# EasyEDA Pro project 串口模块.epro, board 车载蓝牙供电串口V2
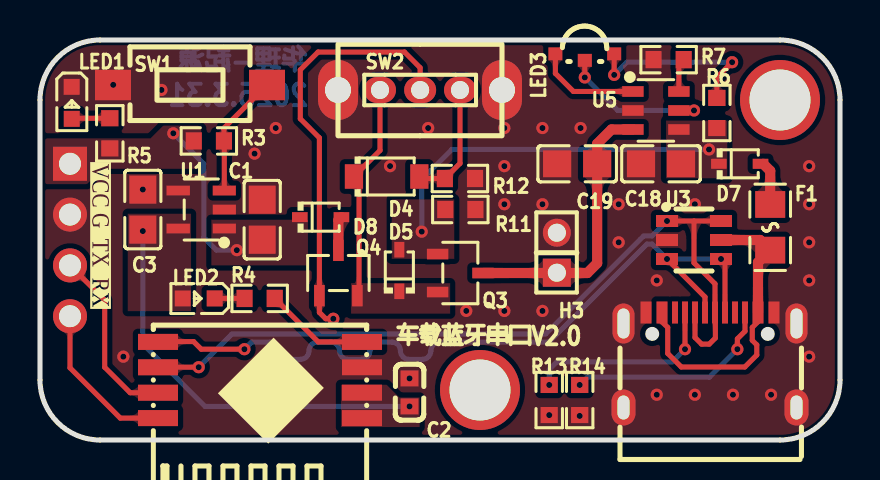
[diagram p8: board, top side]
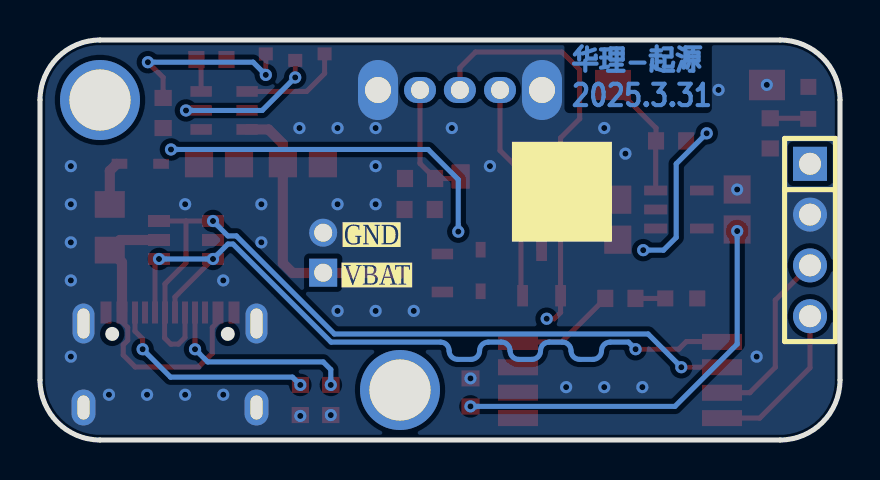
[diagram p9: board, bottom side, seen from below]

Outline 40 x 20 mm; copper layers: Top Layer, Bottom Layer. Coordinates in mm from the lower left corner of the outline.
Outline path: 0,17 0,3 arc(0.88,0.88) 3,0 37,0 arc(39.12,0.88) 40,3 40,17 arc(39.12,19.12) 37,20 3,20 arc(0.88,19.12) 0,17
Stack: Top Layer 0.035mm / Dielectric1 1.51mm FR4 er 4.5 / Bottom Layer 0.035mm

## Design rules (mm)
net D+: DP1
net D-: DP1
template: xyf_v1.1
spacing copperThickness1oz (default): track to track 0.102, other pairs 0.152 to 0.3
spacing copperThickness2oz: track to track 0.203, other pairs 0.152 to 0.3
spacing copperThicknessInner0.5oz: track to track 0.089, other pairs 0.152 to 0.3
spacing 0焊盘板框间距: track to track 0.152, other pairs 0 to 0.3
track width copperThickness1oz (default): min 0.127, default 0.254, max 2.54
track width copperThickness2oz: min 0.203, default 0.254, max 2.54
track width copperThickness0.5oz: min 0.089, default 0.254, max 2.54
differential pair differentialPair (default): width min 0.127, default 0.254, max 2.54; gap min 0.152, default 0.152
via viaSize (default): diameter min 0.5, default 0.61, max 10; hole min 0.3, default 0.305, max 6.3
via viaSize2: diameter min 0.5, default 0.61, max 10; hole min 0.3, default 0.305, max 6.299
via viaSize4: diameter min 0.45, default 0.61, max 10; hole min 0.3, default 0.305, max 6.299

## Placement (name value [footprint] x y rotation side)
C1  10uF  [C0805]  11.11 11.02 270 top
C2  100nF  [C0603]  18.48 2.38 270 top
C3  10uF  [C0805]  5.14 11.52 270 top
C18  10uF  [C0805]  31.05 13.81 0 top
C19  10uF  [C0805]  26.86 13.81 180 top
D4  BZT52C16  [SOD-123_L2.7-W1.6-LS3.7-RD]  17.33 13.17 0 top
D5  B5817WS  [SOD-323_L1.7-W1.3-LS2.5-FD]  17.97 8.48 270 top
D7  B5817WS  [SOD-323_L1.7-W1.3-LS2.5-FD]  34.99 13.81 180 top
D8  B5817WS  [SOD-323_L1.7-W1.3-LS2.5-FD]  14.03 11.14 180 top
F1  SMD0805B050TF  [F0805]  36.51 10.64 270 top
H2  PZ254V-11-04P  [HDR-TH_4P-P2.54-V-M]  1.5 10 270 bottom
H3  PZ200V-11-02P  [HDR-TH_2P-P2.00-V-M]  25.84 9.36 90 top
LED1  XL-1608SURC-06  [LED0603-RD_RED]  1.59 16.86 270 top
LED2  NCD0603Y1  [LED0603-RD]  7.94 7.08 180 top
LED3  A-SP1102DR5G2C-A01-2C  [LED-SMD_3P-L3.0-W1.5_A-SP1102DR6W1D-C01-2C]  27.24 19.14 0 top
Q3  SI2333CDS-T1-MS  [SOT-23-3_L3.0-W1.6-P1.90-LS2.8-BR]  21.02 8.35 180 top
Q4  SI2333CDS-T1-MS  [SOT-23-3_L3.0-W1.6-P1.90-LS2.8-BR]  14.92 8.35 270 top
QR1  -  [JLC-QRCODE-5x5]  13.9 12.41 180 bottom
R3  10kΩ  [R0603]  8.44 14.95 180 top
R4  10kΩ  [R0603]  10.98 7.08 0 top
R5  10kΩ  [R0603]  3.49 15.33 270 top
R6  1kΩ  [R0603]  33.84 16.35 270 top
R7  5.1kΩ  [R0603]  31.43 19.02 180 top
R11  10kΩ  [R0603]  21.02 11.52 180 top
R12  10kΩ  [R0603]  21 13.07 0 top
R13  5.1kΩ  [R0603]  25.46 2 270 top
R14  5.1kΩ  [R0603]  26.99 2 90 top
SCREW1  -  [M2螺丝]  37 17 0 top
SCREW2  -  [M2螺丝]  22 2.5 0 top
SW1  TS3625A  [KEY-SMD_L6.0-W3.5-LS8.4]  7.5 17.75 0 top
SW2  SS-12D02-VG4  [SW-TH_SS-12D02-VG4]  19 17.5 180 top
U1  RT9013-33GB  [SOT-23-5_L3.0-W1.7-P0.95-LS2.8-BL]  8.06 11.52 90 top
U2  BLE-SER-A-ANT  [WIFI-SMD_8P-P1.27_CH9140]  11 3 180 top
U3  USBLC6-2SC6-ES  [SOT-23-6_L2.9-W1.6-P0.95-LS2.8-BR]  32.7 10 180 top
U5  TP4057-42-SOT26-R  [SOT-23-6_L2.9-W1.6-P0.95-LS2.8-BL]  30.79 16.48 270 top
USB1  TYPE-C 16PIN 2MD(073)  [USB-C-SMD_TYPE-C-6PIN-2MD-073]  33.5 4 0 top

## Footprints (pads in the part's own frame, mm; a bottom-side part is the same pattern mirrored in y, then rotated)
C0603
  rect 0.8x0.9 smd: 1(-0.7,0) 2(0.7,0)
C0805
  rect 1.41x1.35 smd: 1(-1,0) 2(1,0)
F0805
  rect 1.335x1.5 smd: 1(-1.143,0) 2(1.143,0)
HDR-TH_2P-P2.00-V-M
  rect 1.4x1.4 hole 0.9: 1(-1,0)
  round 1.4 hole 0.9: 2(1,0)
HDR-TH_4P-P2.54-V-M
  rect 1.7x1.7 hole 1.1: 1(-3.81,0)
  round 1.7 hole 1.1: 2(-1.27,0) 3(1.27,0) 4(3.81,0)
KEY-SMD_L6.0-W3.5-LS8.4
  rect 1.8x1.524 smd: 1(-3.85,0) 2(3.85,0)
LED0603-RD
  rect 0.8x0.8 smd: 1(-0.799,0) 2(0.799,0)
LED0603-RD_RED
  rect 0.8x0.8 smd: 1(-0.799,-0.004) 2(0.799,0.004)
LED-SMD_3P-L3.0-W1.5_A-SP1102DR6W1D-C01-2C
  rect 0.7x0.65 smd: 1(1.47,0.163) 2(0,-0.163) 3(-1.47,0.163)
M2螺丝
  round 4 hole 3.05x2.02: 1(0,0)
R0603
  rect 0.806x0.864 smd: 1(-0.753,0) 2(0.753,0)
SOD-123_L2.7-W1.6-LS3.7-RD
  rect 0.91x1.22 smd: 1(-1.635,0) 2(1.635,0)
SOD-323_L1.7-W1.3-LS2.5-FD
  rect 0.78x0.5 smd: 1(-1.04,0) 2(1.04,0)
SOT-23-3_L3.0-W1.6-P1.90-LS2.8-BR
  rect 1.07x0.532 smd: 1(1.135,-0.95) 2(1.135,0.95) 3(-1.135,0)
SOT-23-5_L3.0-W1.7-P0.95-LS2.8-BL
  rect 0.49x1.157 smd: 1(-0.95,-1.153) 2(0,-1.153) 3(0.95,-1.153)
  rect 0.49x1.175 smd: 4(0.95,1.153) 5(-0.95,1.153)
SOT-23-6_L2.9-W1.6-P0.95-LS2.8-BL
  rect 0.532x1.072 smd: 1(-0.95,-1.149) 2(0,-1.149) 3(0.95,-1.149) 4(0.95,1.149) 5(0,1.149) 6(-0.95,1.149)
SOT-23-6_L2.9-W1.6-P0.95-LS2.8-BR
  rect 1.1x0.6 smd: 1(1.35,-0.95) 2(1.35,0) 3(1.35,0.95) 4(-1.35,0.95) 5(-1.35,0) 6(-1.35,-0.95)
SW-TH_SS-12D02-VG4
  oval 1.6x1.3 hole 0.9: 1(-2,0) 2(-0.006,0) 3(2,0)
  oval 2x3 hole 1.3: 4(4.1,0) 5(-4.1,0)
USB-C-SMD_TYPE-C-6PIN-2MD-073
  rect 0.55x1.1 smd: 1(-3.2,2.375) 2(-2.4,2.375) 11(2.4,2.375) 12(3.2,2.375)
  rect 0.3x1.1 smd: 3(-1.75,2.375) 4(-1.25,2.375) 5(-0.75,2.375) 6(-0.25,2.375) 7(0.25,2.375) 8(0.75,2.375) 9(1.25,2.375) 10(1.75,2.375)
  oval 1.1x2 hole 0.6x1.5: 13(-4.325,1.825) 14(4.325,1.825)
  oval 1.2x1.8 hole 0.6x1.2: 13(-4.325,-2.375) 14(4.325,-2.375)
WIFI-SMD_8P-P1.27_CH9140
  rect 2x0.8 smd: 1(-5.1,1.905) 2(-5.1,0.635) 3(-5.1,-0.635) 4(-5.1,-1.905) 5(5.1,-1.905) 6(5.1,-0.635) 7(5.1,0.635) 8(5.1,1.905)

## Nets
As in the schematic.

Pads without a net: SCREW1 1; SCREW2 1; USB1 3 9

## Via types
v1: diameter 0.61, hole 0.305, Top Layer to Bottom Layer, 56 vias

## Routing (per net, layer and track width the routed paths; a pad name or vN(x,y) marks a point on that pad's centre or on a via; arc(x,y) is an arc through that point)
3V3: length 20.3
  Bottom Layer w0.254: v1(18.48,1.68) 8.25,1.68 5.14,4.79 v1(5.14,10.45)
GND:
  vias: v1(3.66,17.76) v1(4.17,4.17) v1(5.14,12.52) v1(6.07,17.5) v1(9.88,2.64) v1(10.73,14.32) v1(11.79,15.6) v1(11.79,2.64) v1(13.69,2.64) v1(17.5,13.69) v1(18.48,3.08) v1(19.41,15.6) v1(21.31,6.45) v1(23.22,15.6) v1(23.22,13.69) v1(23.22,11.79) v1(23.22,6.45) v1(25.12,15.6) v1(25.12,11.79) v1(25.12,6.45) v1(25.46,1.25) v1(27.03,15.6) v1(26.99,1.2) v1(28.93,11.79) v1(28.93,9.88) v1(30.84,7.98) v1(30.84,2.26) v1(32.74,11.79) v1(32.74,2.26) v1(34.65,2.26) v1(36.55,2.26) v1(38.46,13.69) v1(38.46,11.79) v1(38.46,9.88) v1(38.46,7.98) v1(38.46,4.17)
VBAT: length 14
  Top Layer w0.508: 22.15,8.35 25.83,8.35 H3.1 25.86,8.35 27.37,8.35 27.86,8.84 C19.1 27.86,14.81 28.57,15.53 U5.3
VIN: length 17.6
  Bottom Layer w0.254: v1(33.45,14.53) 20.59,14.53 19.09,13.02 v1(19.09,10.42)
D+: length 40
  Top Layer w0.254: USB1.6 33.25,7.15 v1(31.35,9.05) ; v1(34.05,9.05) 34.25,8.85 USB1.8 ; v1(10.22,4.54) 8.06,4.54 7.68,4.92 5.91,4.92 U2.5
  Bottom Layer w0.254: v1(34.05,9.05) v1(31.35,9.05) 30.6,9.8 30.35,9.8 25.45,4.89 19.98,4.89 arc(19.67,4.77) 19.54,4.46 arc(19.42,4.16) 19.11,4.03 18.45,4.03 arc(18.15,4.16) 18.02,4.46 arc(17.89,4.77) 17.59,4.89 16.93,4.89 arc(16.62,4.77) 16.5,4.46 arc(16.37,4.16) 16.06,4.03 15.41,4.03 arc(15.1,4.16) 14.97,4.46 arc(14.85,4.77) 14.54,4.89 13.88,4.89 arc(13.58,4.77) 13.45,4.46 arc(13.32,4.16) 13.02,4.03 12.36,4.03 arc(12.05,4.16) 11.93,4.46 arc(11.8,4.77) 11.49,4.89 10.58,4.89 v1(10.22,4.54)
D-: length 40
  Top Layer w0.254: 32.7,10.95 v1(31.35,10.95) ; 32.7,10.95 U3.6 ; 32.7,10.95 32.7,8.86 33.75,7.81 USB1.7 33.77,6.36 33.77,5.1 33.46,4.79 33.08,4.79 32.75,5.12 USB1.5 ; v1(7.94,3.64) 5.9,3.64 U2.6
  Bottom Layer w0.254: v1(7.94,3.64) 9.6,5.3 25.28,5.3 30.18,10.2 30.6,10.2 v1(31.35,10.95)
RX: length 8
  Top Layer w0.254: U2.8 4.01,1.09 1.5,3.61 H2.4
STDBY: length 7.8
  Top Layer w0.254: U5.5 v1(32.7,16.48) ; LED3.2 v1(27.24,18.13)
  Bottom Layer w0.254: v1(27.24,18.13) 28.89,16.48 v1(32.7,16.48)
TX: length 9
  Top Layer w0.254: U2.7 4.51,2.36 3.24,3.64 3.24,6.99 H2.3
VCH: length 7.8
  Bottom Layer w0.254: v1(9.84,9.49) 8.82,9.49 8.19,10.13 8.19,13.81 v1(6.66,15.33)
$1N600: length 5.3
  Top Layer w0.254: R4.2 13.91,4.91 U2.4
$1N1806: length 1.9
  Top Layer w0.254: LED1.2 1.62,16.09 R5.1
$1N3665: length 15.5
  Top Layer w0.254: USB1.11 35.9,5.91 35.61,5.63 35.61,4.98 35.84,4.76 35.84,4.25 35.24,3.65 32.06,3.65 31.39,4.33 31.39,5.63 31.1,5.91 USB1.2
  Top Layer w0.508: U3.5 36,10 F1.2 35.9,8.88 USB1.11
$1N4390: length 1.5
  Top Layer w0.254: R4.1 LED2.1
$1N10597: length 5.2
  Top Layer w0.254: LED3.3 25.77,18.33 26.67,17.43 U5.1
$1N10598: length 9.3
  Top Layer w0.254: v1(34.6,18.89) 33.84,18.13 R6.1 ; LED3.1 v1(28.71,18.25)
  Bottom Layer w0.254: v1(28.71,18.25) 29.34,18.89 v1(34.6,18.89)
$1N10601: length 1.7
  Top Layer w0.254: U5.6 31.94,18.78 R7.1
$1N10971: length 21.2
  Top Layer w0.254: v1(14.67,6.06) 14.28,6.06 13.97,6.38 Q4.1 13.97,15.11 13.01,16.06 13.01,18.51 13.9,19.4 18.22,19.4 19.01,18.61 SW2.2
$1N11056: length 10.6
  Top Layer w0.254: v1(34.87,4.54) 34.87,5.06 35.25,5.44 USB1.10
  Bottom Layer w0.254: v1(26.99,2.75) 27.37,3.14 33.47,3.14 v1(34.87,4.54)
$1N11061: length 9.8
  Top Layer w0.254: USB1.4 v1(32.25,4.54)
  Bottom Layer w0.254: v1(25.46,2.75) 25.46,3.52 25.84,3.9 31.62,3.9 v1(32.25,4.54)
$1N12744: length 2.2
  Top Layer w0.508: F1.1 36.51,13.46 36.16,13.81
$1N13173: length 11.2
  Top Layer w0.254: SW2.3 17,14.48 D4.1 15.7,13.05 15.95,12.79 15.95,6.94
$1N15369: length 6.2
  Top Layer w0.254: U1.3 9.22,14.93 R3.1 9.2,15.6 SW1.2
$1N15531: length 6.1
  Top Layer w0.254: D4.2 19.07,13.07 R12.1 21,13.83 SW2.1
$1N20281: length 1.7
  Top Layer w0.508: Q4.3 14.92,10.99 D8.1

## Copper pours and planes (outline as drawn; the poured copper is in the pictures)
3V3 on Top Layer: 15.05,2.76 18.98,2.76 18.98,0.65 15.05,0.65
3V3 on Top Layer: 4.39,11.31 7.55,11.31 7.55,6.44 4.39,6.44
GND on Top Layer: -0.96,22.57 41.72,22.57 41.72,-2.7 -0.96,-2.7
GND on Bottom Layer: -0.96,22.57 41.72,22.57 41.72,-2.7 -0.96,-2.7
VIN on Top Layer: 17.59,12.03 20.71,12.03 20.71,9.06 17.59,9.06
VIN on Top Layer: 31.3,15.97 34.37,15.97 34.37,13.08 31.3,13.08
VCH on Top Layer: -0.46,15.08 5.52,15.08 6.16,15.72 7.94,15.72 8.06,15.59 8.06,13.56 3.11,13.56 2.35,12.79 -0.46,12.79
VCH on Top Layer: 8.57,11.02 13.4,11.02 13.4,8.73 8.57,8.73
$1N13173 on Top Layer: 15.56,7.84 20.51,7.84 20.51,6.32 15.56,6.32

Small or netless copper shapes (teardrops, artwork), in the pictures only: 72 on Top Layer, 20 on Bottom Layer

## Text on the board
Bottom Layer: 华理-起源 / 2025.3.31
Bottom Silkscreen Layer: GND | VBAT
Top Silkscreen Layer: VCC G  TX  RX | 车载蓝牙串口V2.0
